# Altium schematic sheet 0244_GPU DECOUPLING_ VC.SchDoc
size 848 x 558 mm
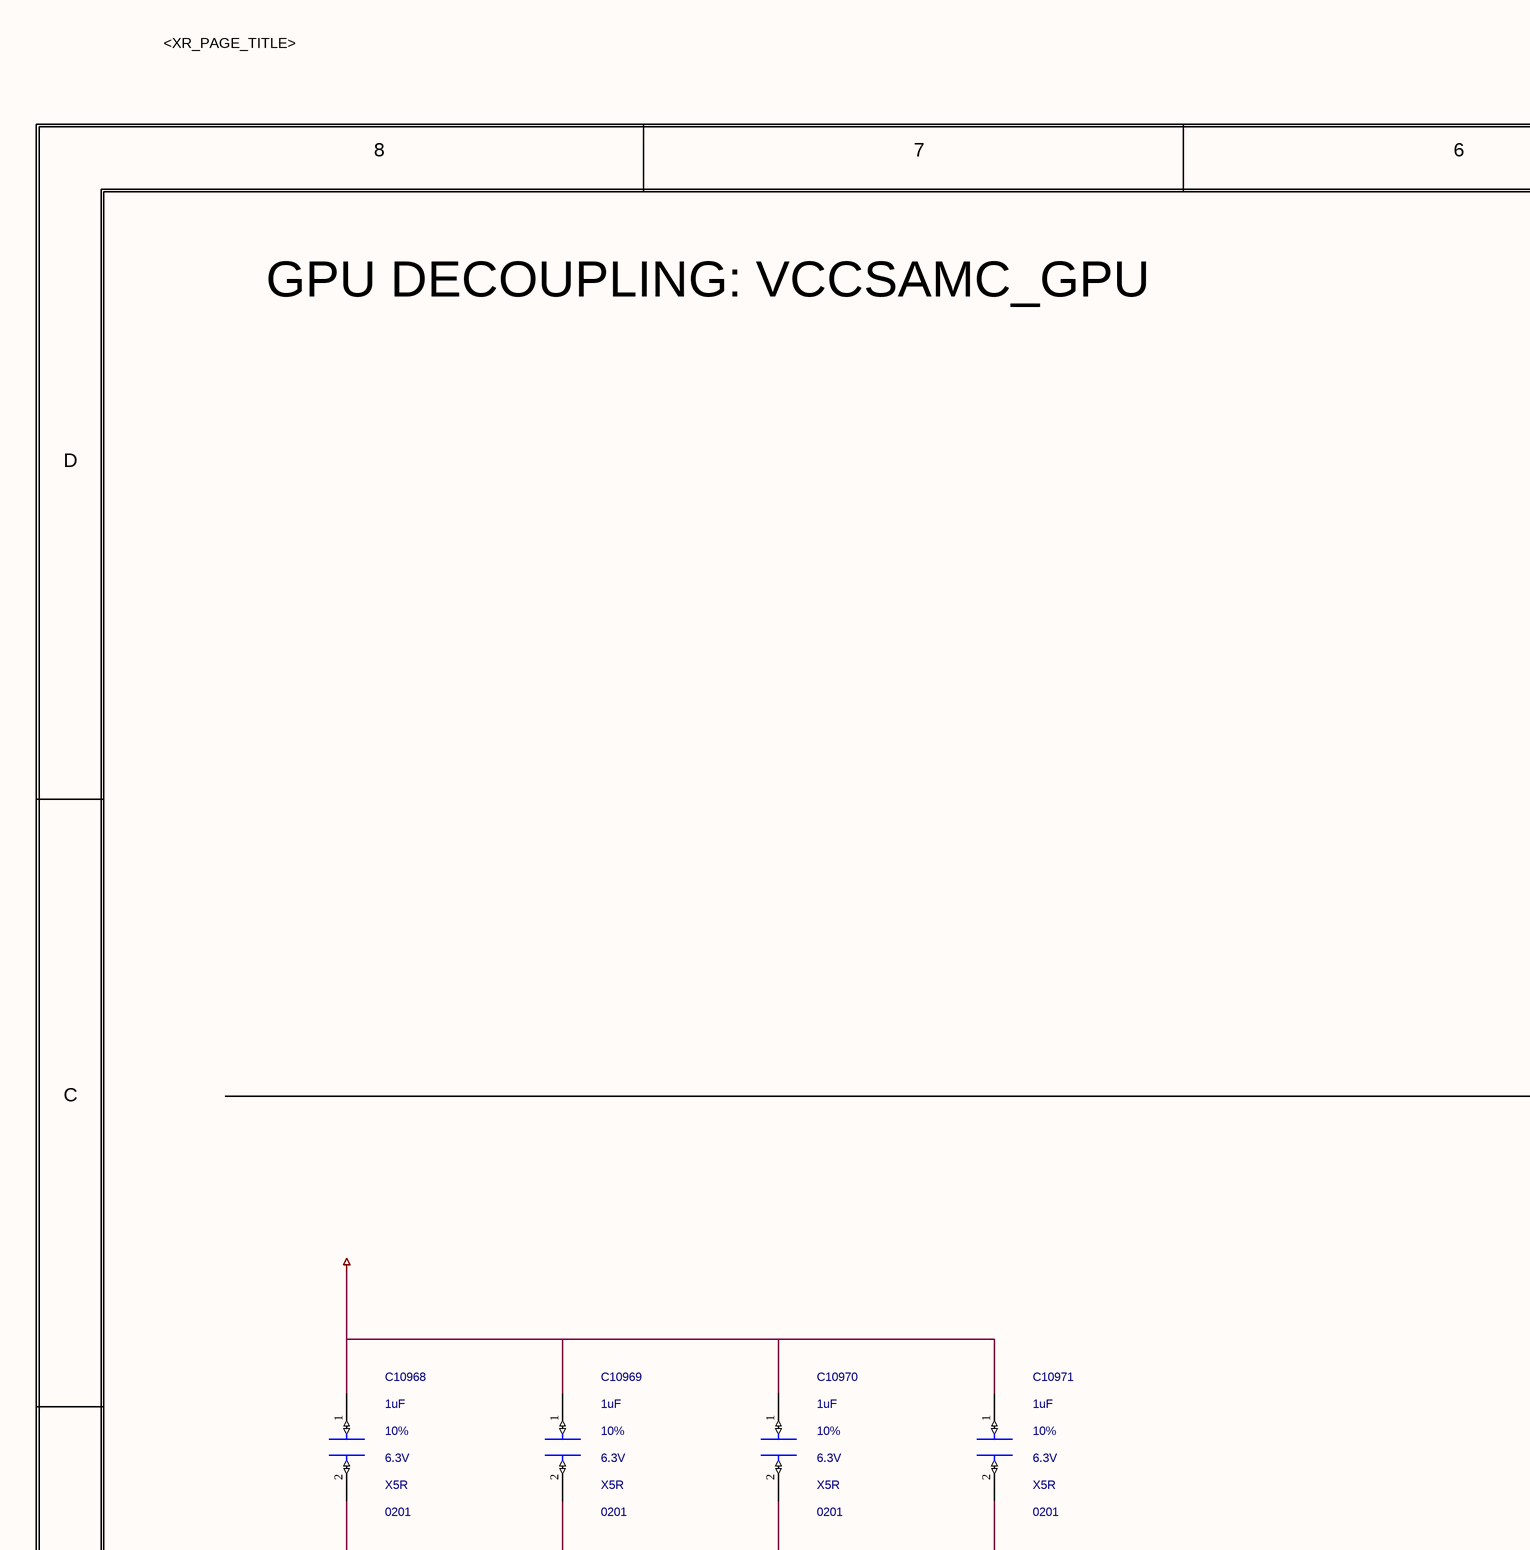
[diagram p0: 0244_GPU DECOUPLING_ VC.SchDoc, top left]
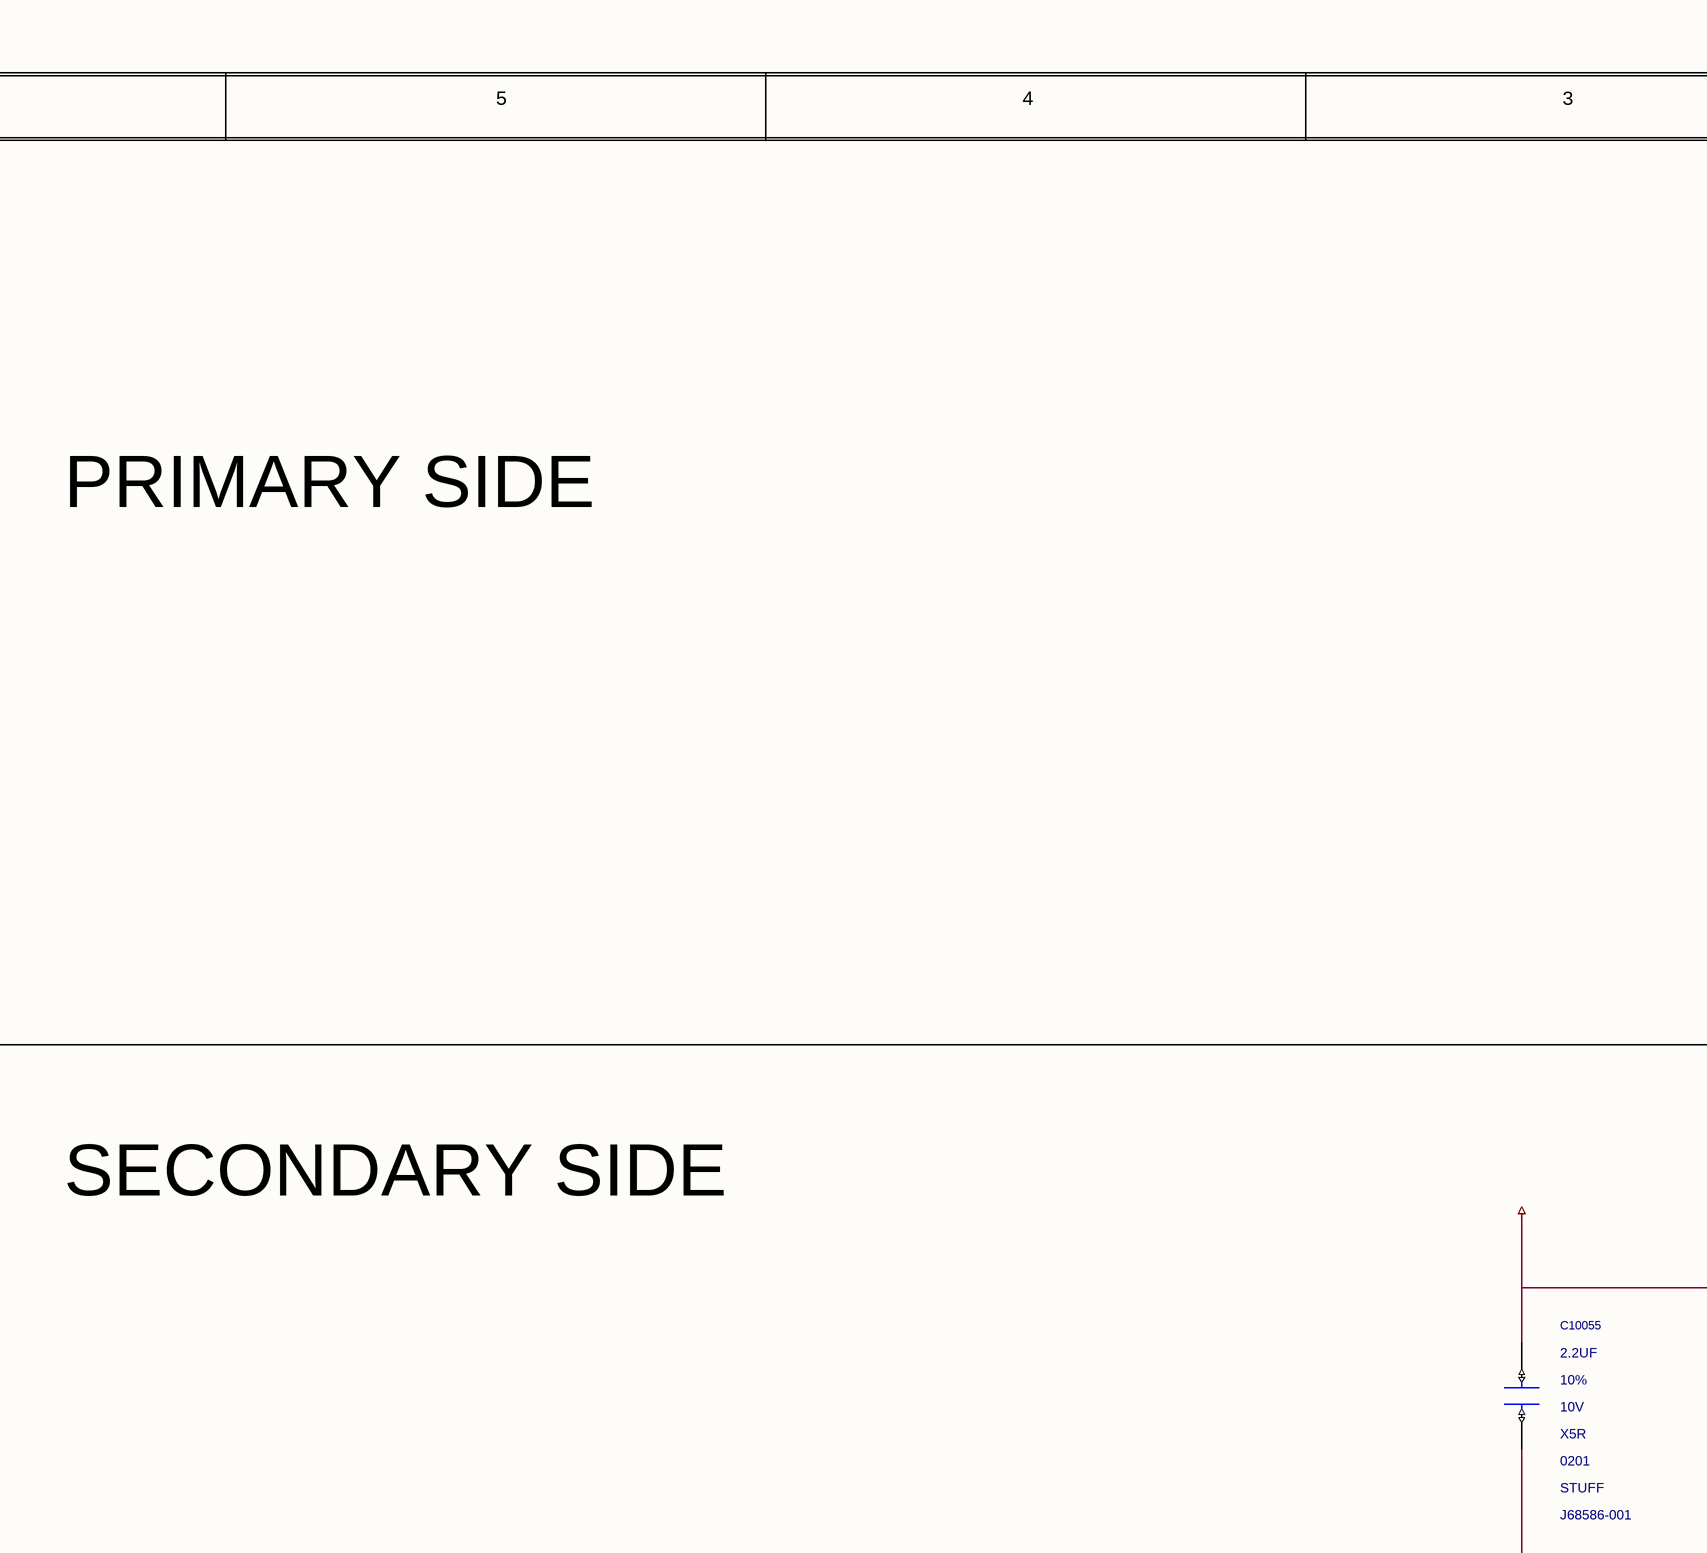
[diagram p1: 0244_GPU DECOUPLING_ VC.SchDoc, top middle]
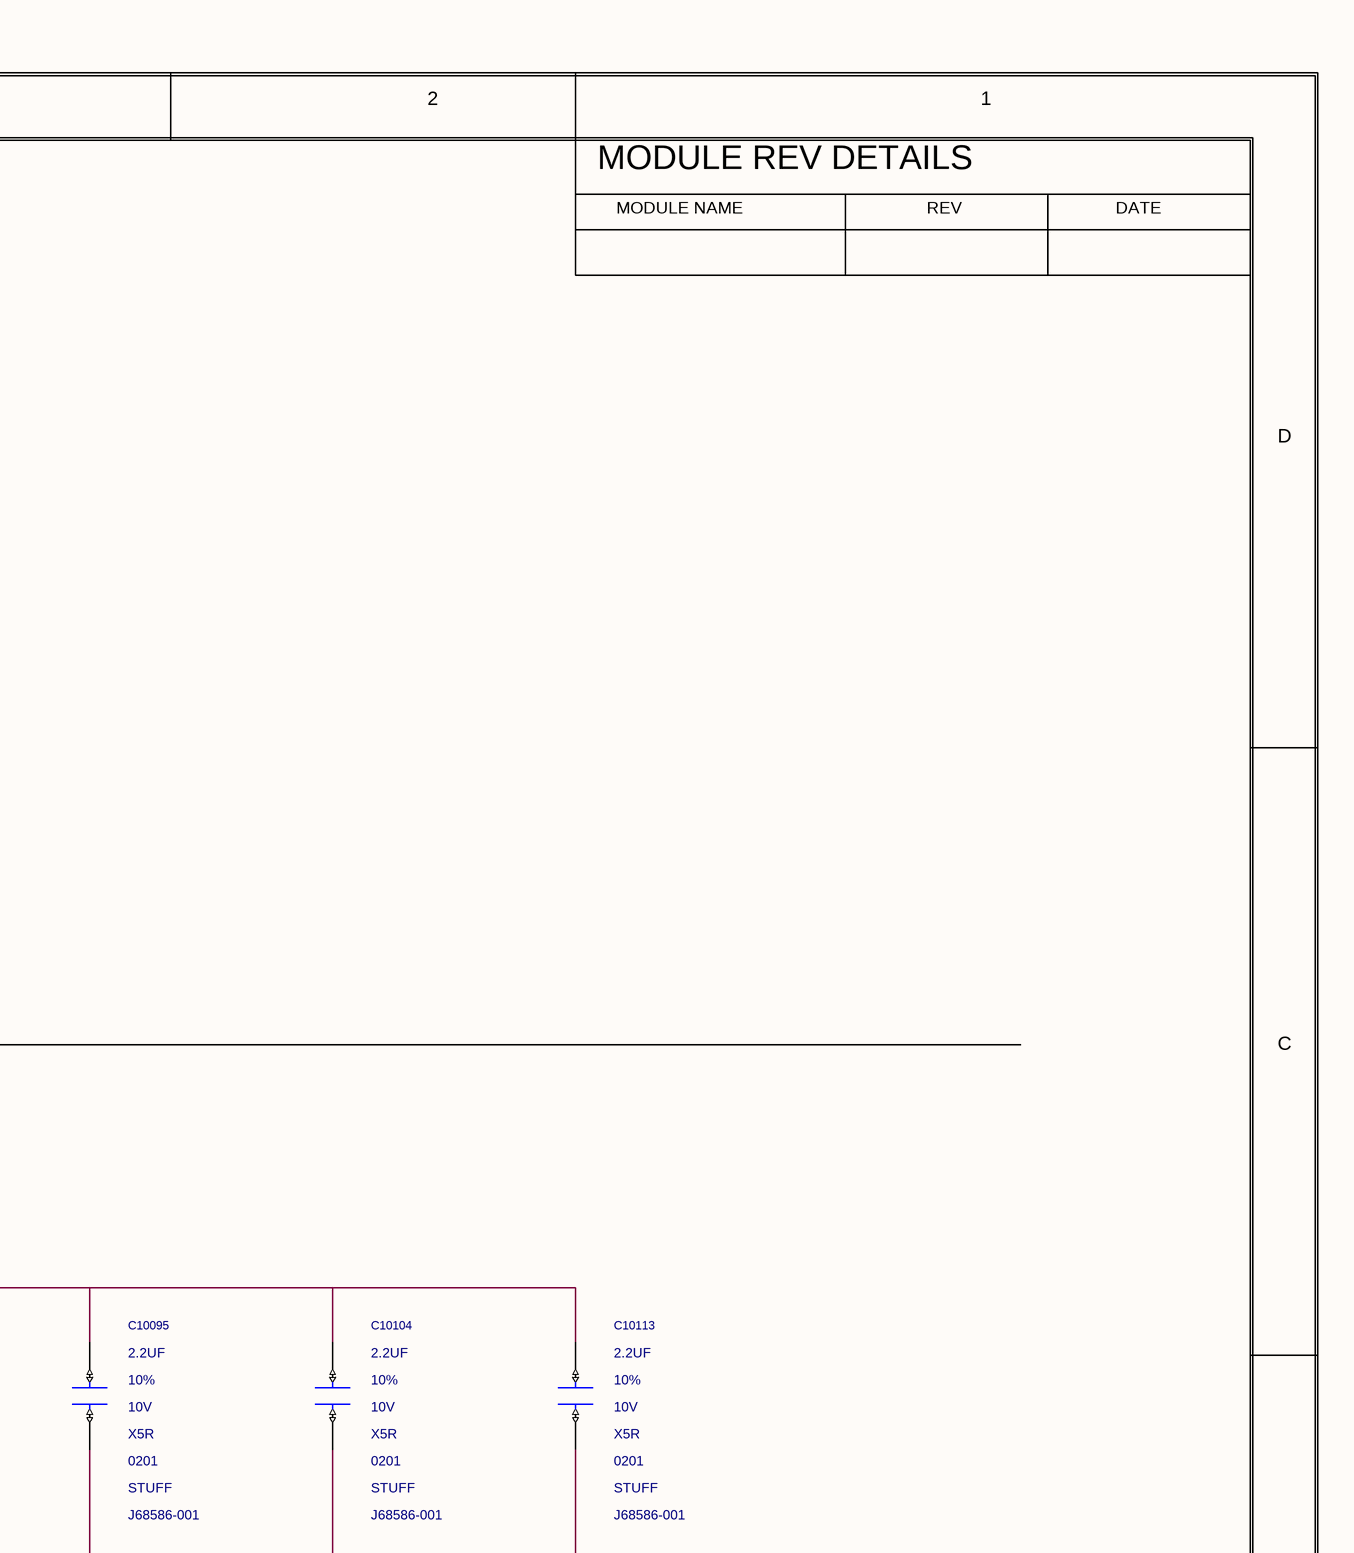
[diagram p2: 0244_GPU DECOUPLING_ VC.SchDoc, top right]
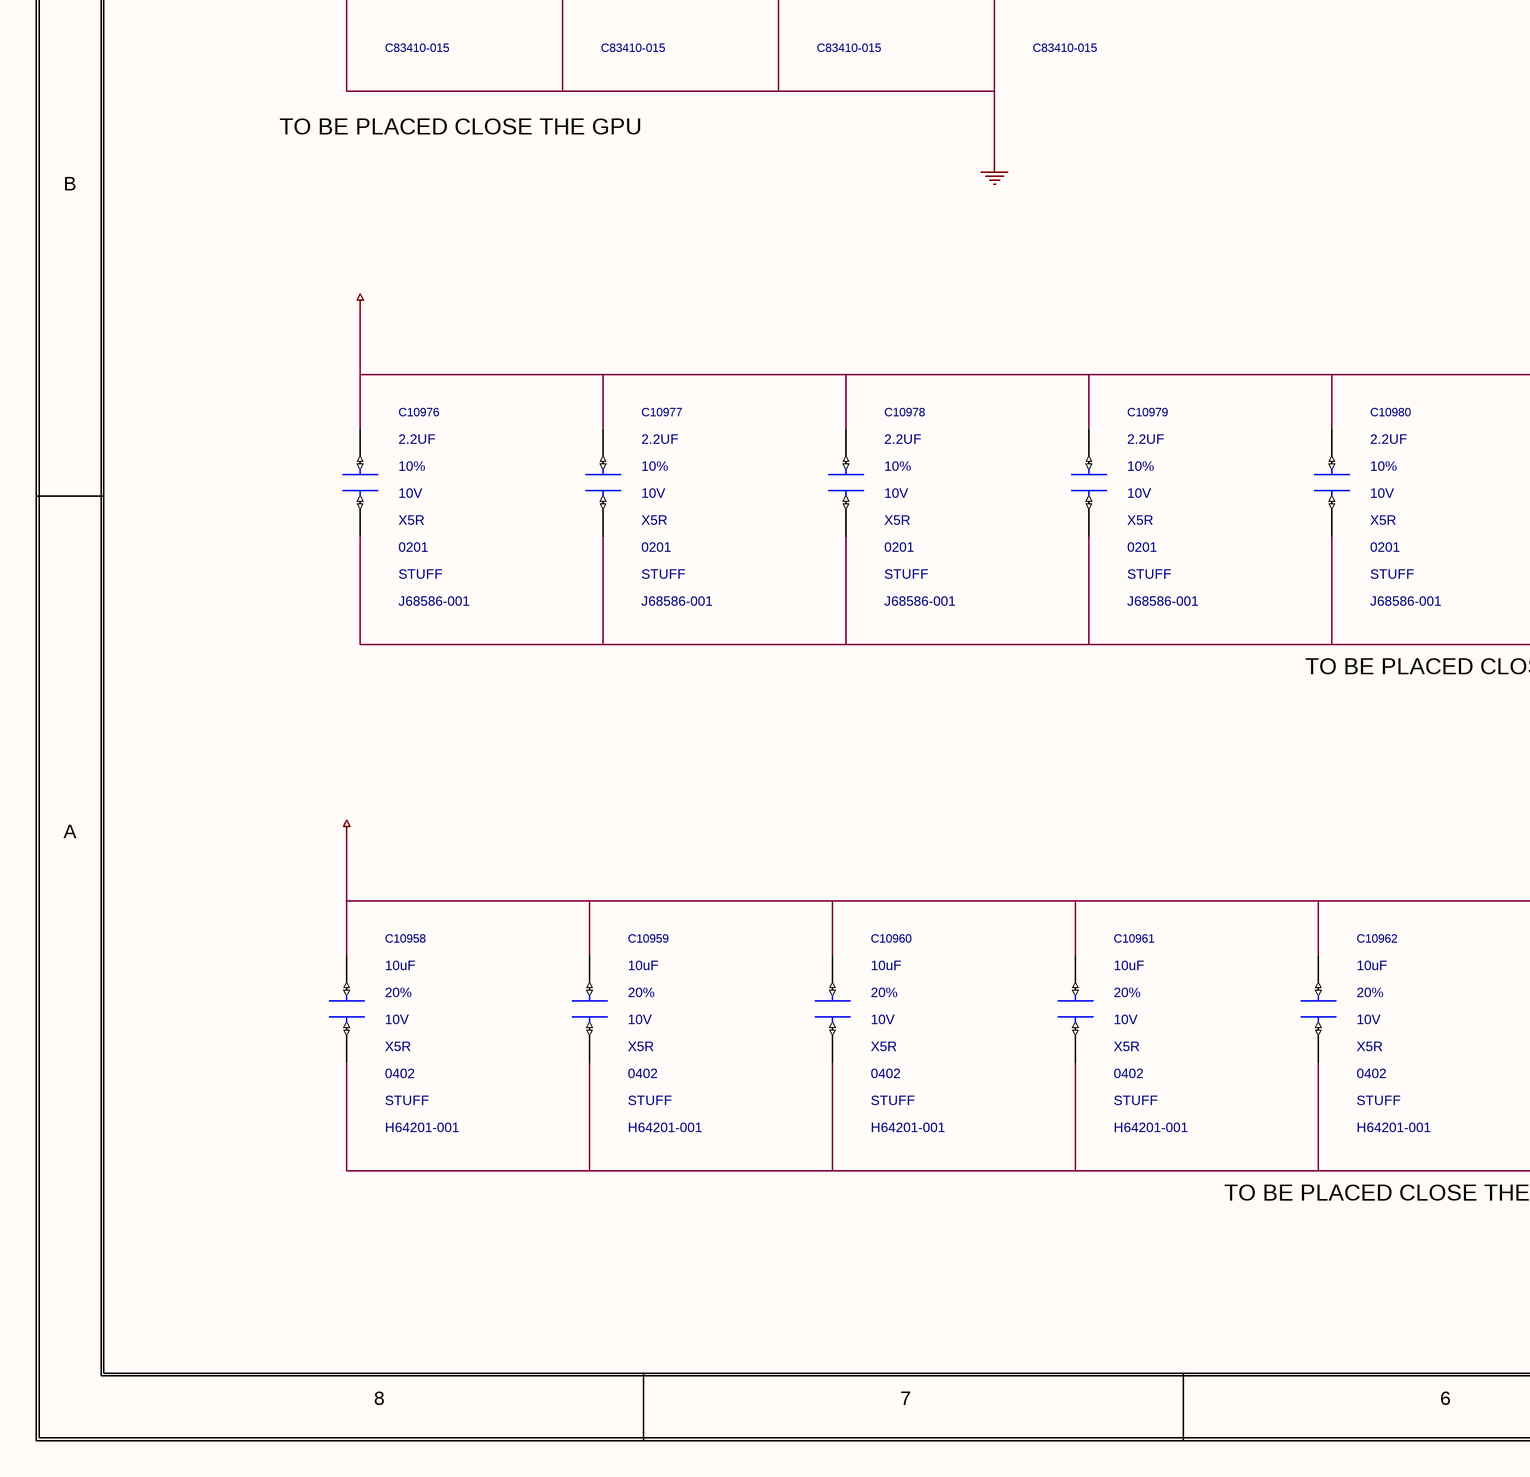
[diagram p3: 0244_GPU DECOUPLING_ VC.SchDoc, bottom left]
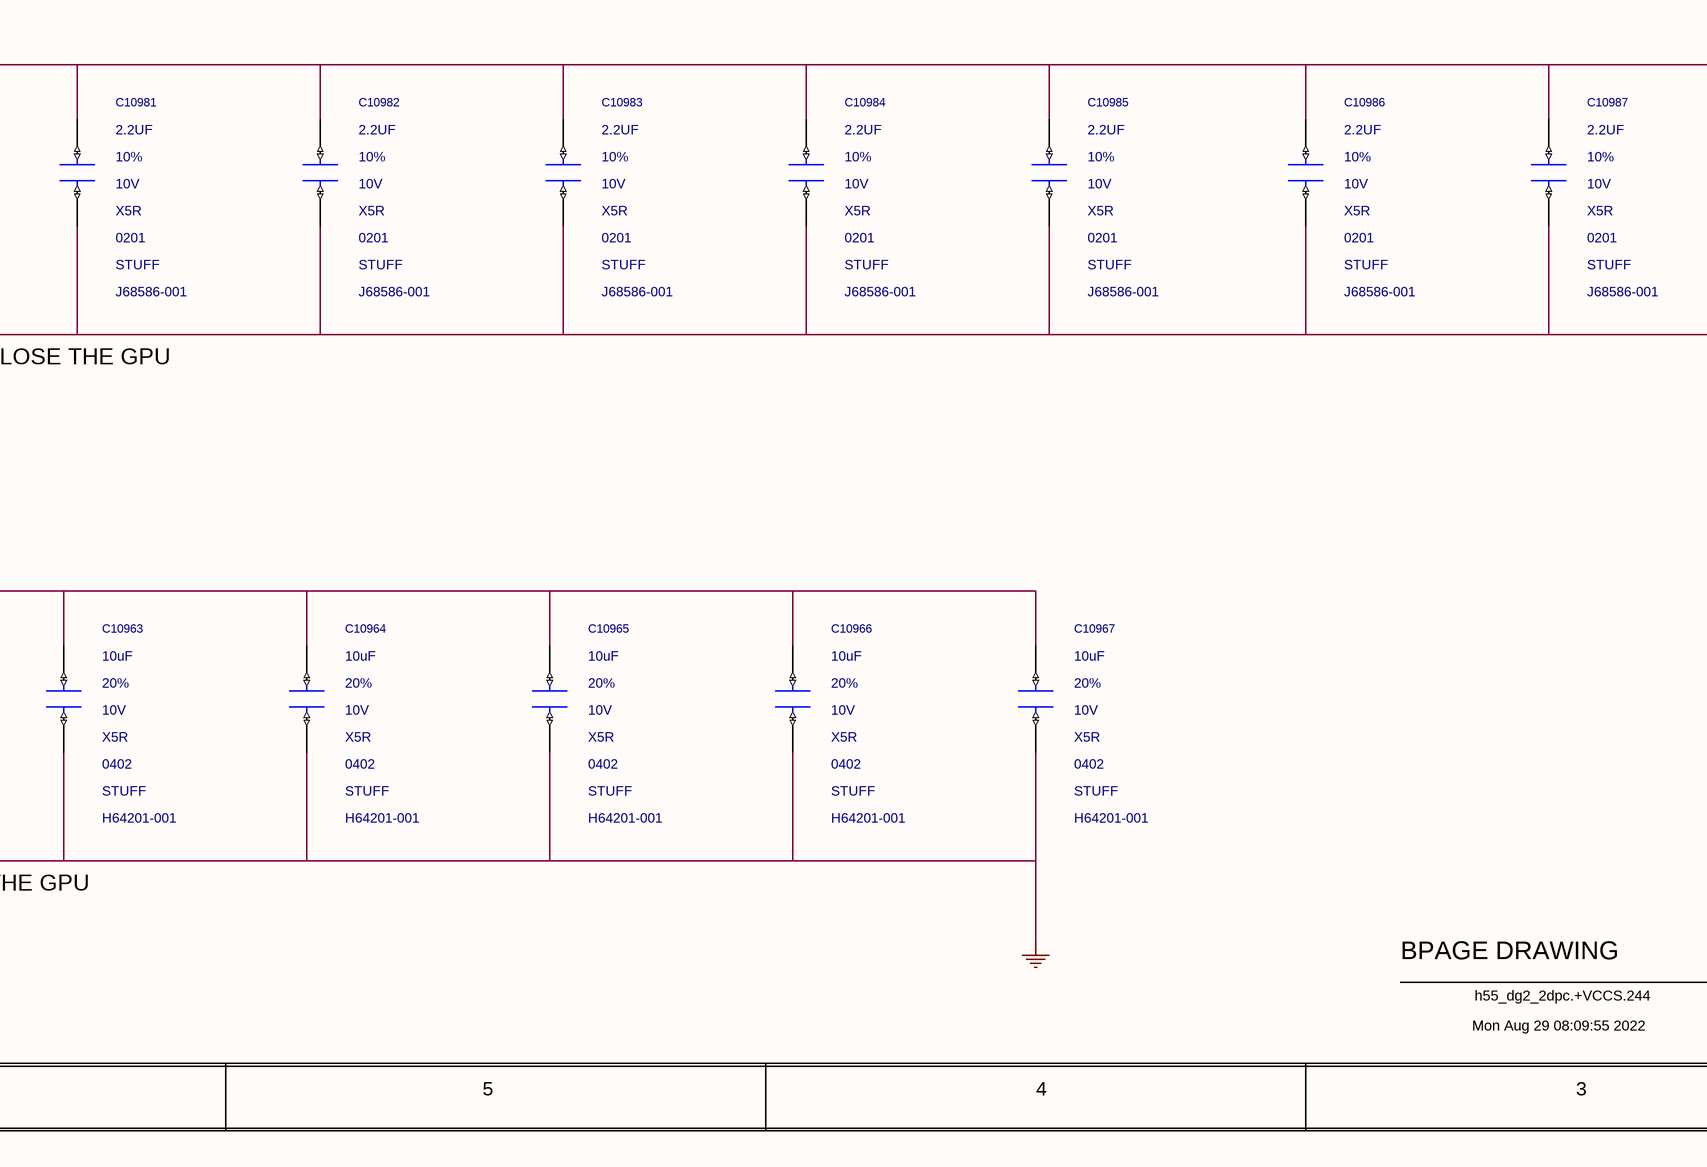
[diagram p4: 0244_GPU DECOUPLING_ VC.SchDoc, bottom middle]
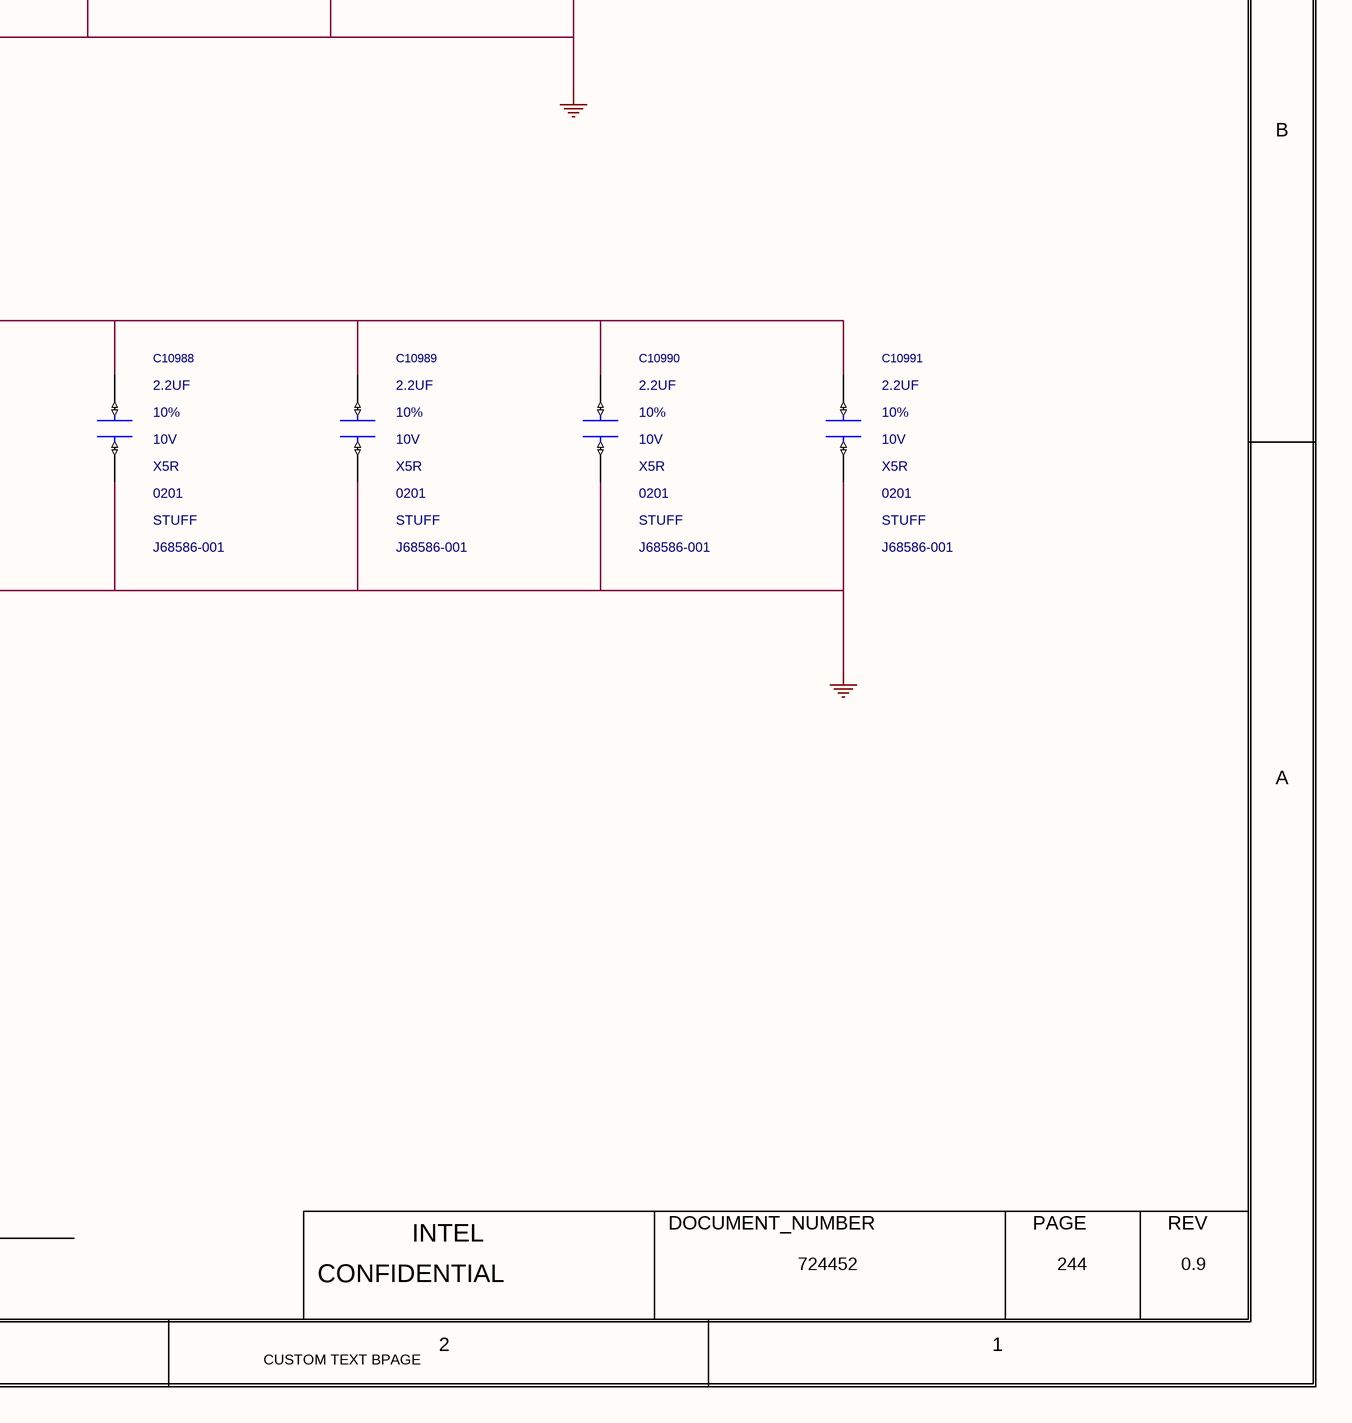
[diagram p5: 0244_GPU DECOUPLING_ VC.SchDoc, bottom right]

## Parts
C10055  2.2UF  BOM_USE: STUFF  MATERIAL: X5R  PACK_TYPE: 0201  PART_NUMBER: J68586-001  TOLERANCE: 10%  VOLTAGE: 10V  [TK0_SM0201_690X390_MC]
C10095  2.2UF  BOM_USE: STUFF  MATERIAL: X5R  PACK_TYPE: 0201  PART_NUMBER: J68586-001  TOLERANCE: 10%  VOLTAGE: 10V  [TK0_SM0201_690X390_MC]
C10104  2.2UF  BOM_USE: STUFF  MATERIAL: X5R  PACK_TYPE: 0201  PART_NUMBER: J68586-001  TOLERANCE: 10%  VOLTAGE: 10V  [TK0_SM0201_690X390_MC]
C10113  2.2UF  BOM_USE: STUFF  MATERIAL: X5R  PACK_TYPE: 0201  PART_NUMBER: J68586-001  TOLERANCE: 10%  VOLTAGE: 10V  [TK0_SM0201_690X390_MC]
C10958  10uF  BOM_USE: STUFF  MATERIAL: X5R  PACK_TYPE: 0402  PART_NUMBER: H64201-001  TOLERANCE: 20%  VOLTAGE: 10V  [TK0_SM0402_1200X700_MF]
C10959  10uF  BOM_USE: STUFF  MATERIAL: X5R  PACK_TYPE: 0402  PART_NUMBER: H64201-001  TOLERANCE: 20%  VOLTAGE: 10V  [TK0_SM0402_1200X700_MF]
C10960  10uF  BOM_USE: STUFF  MATERIAL: X5R  PACK_TYPE: 0402  PART_NUMBER: H64201-001  TOLERANCE: 20%  VOLTAGE: 10V  [TK0_SM0402_1200X700_MF]
C10961  10uF  BOM_USE: STUFF  MATERIAL: X5R  PACK_TYPE: 0402  PART_NUMBER: H64201-001  TOLERANCE: 20%  VOLTAGE: 10V  [TK0_SM0402_1200X700_MF]
C10962  10uF  BOM_USE: STUFF  MATERIAL: X5R  PACK_TYPE: 0402  PART_NUMBER: H64201-001  TOLERANCE: 20%  VOLTAGE: 10V  [TK0_SM0402_1200X700_MF]
C10963  10uF  BOM_USE: STUFF  MATERIAL: X5R  PACK_TYPE: 0402  PART_NUMBER: H64201-001  TOLERANCE: 20%  VOLTAGE: 10V  [TK0_SM0402_1200X700_MF]
C10964  10uF  BOM_USE: STUFF  MATERIAL: X5R  PACK_TYPE: 0402  PART_NUMBER: H64201-001  TOLERANCE: 20%  VOLTAGE: 10V  [TK0_SM0402_1200X700_MF]
C10965  10uF  BOM_USE: STUFF  MATERIAL: X5R  PACK_TYPE: 0402  PART_NUMBER: H64201-001  TOLERANCE: 20%  VOLTAGE: 10V  [TK0_SM0402_1200X700_MF]
C10966  10uF  BOM_USE: STUFF  MATERIAL: X5R  PACK_TYPE: 0402  PART_NUMBER: H64201-001  TOLERANCE: 20%  VOLTAGE: 10V  [TK0_SM0402_1200X700_MF]
C10967  10uF  BOM_USE: STUFF  MATERIAL: X5R  PACK_TYPE: 0402  PART_NUMBER: H64201-001  TOLERANCE: 20%  VOLTAGE: 10V  [TK0_SM0402_1200X700_MF]
C10968  1uF  MATERIAL: X5R  PACK_TYPE: 0201  PART_NUMBER: C83410-015  TOLERANCE: 10%  VOLTAGE: 6.3V  [SMC0201IA]
C10969  1uF  MATERIAL: X5R  PACK_TYPE: 0201  PART_NUMBER: C83410-015  TOLERANCE: 10%  VOLTAGE: 6.3V  [SMC0201IA]
C10970  1uF  MATERIAL: X5R  PACK_TYPE: 0201  PART_NUMBER: C83410-015  TOLERANCE: 10%  VOLTAGE: 6.3V  [SMC0201IA]
C10971  1uF  MATERIAL: X5R  PACK_TYPE: 0201  PART_NUMBER: C83410-015  TOLERANCE: 10%  VOLTAGE: 6.3V  [SMC0201IA]
C10976  2.2UF  BOM_USE: STUFF  MATERIAL: X5R  PACK_TYPE: 0201  PART_NUMBER: J68586-001  TOLERANCE: 10%  VOLTAGE: 10V  [TK0_SM0201_690X390_MC]
C10977  2.2UF  BOM_USE: STUFF  MATERIAL: X5R  PACK_TYPE: 0201  PART_NUMBER: J68586-001  TOLERANCE: 10%  VOLTAGE: 10V  [TK0_SM0201_690X390_MC]
C10978  2.2UF  BOM_USE: STUFF  MATERIAL: X5R  PACK_TYPE: 0201  PART_NUMBER: J68586-001  TOLERANCE: 10%  VOLTAGE: 10V  [TK0_SM0201_690X390_MC]
C10979  2.2UF  BOM_USE: STUFF  MATERIAL: X5R  PACK_TYPE: 0201  PART_NUMBER: J68586-001  TOLERANCE: 10%  VOLTAGE: 10V  [TK0_SM0201_690X390_MC]
C10980  2.2UF  BOM_USE: STUFF  MATERIAL: X5R  PACK_TYPE: 0201  PART_NUMBER: J68586-001  TOLERANCE: 10%  VOLTAGE: 10V  [TK0_SM0201_690X390_MC]
C10981  2.2UF  BOM_USE: STUFF  MATERIAL: X5R  PACK_TYPE: 0201  PART_NUMBER: J68586-001  TOLERANCE: 10%  VOLTAGE: 10V  [TK0_SM0201_690X390_MC]
C10982  2.2UF  BOM_USE: STUFF  MATERIAL: X5R  PACK_TYPE: 0201  PART_NUMBER: J68586-001  TOLERANCE: 10%  VOLTAGE: 10V  [TK0_SM0201_690X390_MC]
C10983  2.2UF  BOM_USE: STUFF  MATERIAL: X5R  PACK_TYPE: 0201  PART_NUMBER: J68586-001  TOLERANCE: 10%  VOLTAGE: 10V  [TK0_SM0201_690X390_MC]
C10984  2.2UF  BOM_USE: STUFF  MATERIAL: X5R  PACK_TYPE: 0201  PART_NUMBER: J68586-001  TOLERANCE: 10%  VOLTAGE: 10V  [TK0_SM0201_690X390_MC]
C10985  2.2UF  BOM_USE: STUFF  MATERIAL: X5R  PACK_TYPE: 0201  PART_NUMBER: J68586-001  TOLERANCE: 10%  VOLTAGE: 10V  [TK0_SM0201_690X390_MC]
C10986  2.2UF  BOM_USE: STUFF  MATERIAL: X5R  PACK_TYPE: 0201  PART_NUMBER: J68586-001  TOLERANCE: 10%  VOLTAGE: 10V  [TK0_SM0201_690X390_MC]
C10987  2.2UF  BOM_USE: STUFF  MATERIAL: X5R  PACK_TYPE: 0201  PART_NUMBER: J68586-001  TOLERANCE: 10%  VOLTAGE: 10V  [TK0_SM0201_690X390_MC]
C10988  2.2UF  BOM_USE: STUFF  MATERIAL: X5R  PACK_TYPE: 0201  PART_NUMBER: J68586-001  TOLERANCE: 10%  VOLTAGE: 10V  [TK0_SM0201_690X390_MC]
C10989  2.2UF  BOM_USE: STUFF  MATERIAL: X5R  PACK_TYPE: 0201  PART_NUMBER: J68586-001  TOLERANCE: 10%  VOLTAGE: 10V  [TK0_SM0201_690X390_MC]
C10990  2.2UF  BOM_USE: STUFF  MATERIAL: X5R  PACK_TYPE: 0201  PART_NUMBER: J68586-001  TOLERANCE: 10%  VOLTAGE: 10V  [TK0_SM0201_690X390_MC]
C10991  2.2UF  BOM_USE: STUFF  MATERIAL: X5R  PACK_TYPE: 0201  PART_NUMBER: J68586-001  TOLERANCE: 10%  VOLTAGE: 10V  [TK0_SM0201_690X390_MC]

## Nets
+VCCSAMC_GPU: C10055.1(A) C10095.1(A) C10104.1(A) C10113.1(A) C10958.1(A) C10959.1(A) C10960.1(A) C10961.1(A) C10962.1(A) C10963.1(A) C10964.1(A) C10965.1(A) C10966.1(A) C10967.1(A) C10968.1(A) C10969.1(A) C10970.1(A) C10971.1(A) C10976.1(A) C10977.1(A) C10978.1(A) C10979.1(A) C10980.1(A) C10981.1(A) C10982.1(A) C10983.1(A) C10984.1(A) C10985.1(A) C10986.1(A) C10987.1(A) C10988.1(A) C10989.1(A) C10990.1(A) C10991.1(A)
GND: C10055.2(B) C10095.2(B) C10104.2(B) C10113.2(B) C10958.2(B) C10959.2(B) C10960.2(B) C10961.2(B) C10962.2(B) C10963.2(B) C10964.2(B) C10965.2(B) C10966.2(B) C10967.2(B) C10968.2(B) C10969.2(B) C10970.2(B) C10971.2(B) C10976.2(B) C10977.2(B) C10978.2(B) C10979.2(B) C10980.2(B) C10981.2(B) C10982.2(B) C10983.2(B) C10984.2(B) C10985.2(B) C10986.2(B) C10987.2(B) C10988.2(B) C10989.2(B) C10990.2(B) C10991.2(B)

## Notes on the sheet
- <XR_PAGE_TITLE>
- 8
- 7
- 6
- 5
- 4
- 3
- 2
- 1
- MODULE REV DETAILS
- GPU DECOUPLING: VCCSAMC_GPU
- MODULE NAME
- REV
- DATE
- D
- PRIMARY SIDE
- C
- SECONDARY SIDE
- TO BE PLACED CLOSE THE GPU
- B
- A
- BPAGE DRAWING
- INTEL
- DOCUMENT_NUMBER
- PAGE
- Mon Aug 29 08:09:55 2022
- h55_dg2_2dpc.+VCCS.244
- CONFIDENTIAL
- 724452
- 244
- 0.9
- CUSTOM TEXT BPAGE

## Library data of the parts
C10055 = CAP_2: CDS_PHYS_PART_NAME: CAP_2_0201-J68586-001,X5R,2.2UF,10V,10%,TK0,GENERIC; CDS_LMAN_SYM_OUTLINE: -50,50,50,-50; FP_TECH: TK0; IP: GENERIC; ROOM: NONE; OriginalSymbolOrigin: (-50,25); XY: (2625,1650); VER: 1; ROT: 0; PHYS_PAGE: 244; LOCATION: C10055; DRAWING: @RVP1_ADL_SB_ADP_S_DDR5_SODIMM_2DPC_LIB.H55_DG2_2DPC(SCH_1):PAGE415; CDS_LIB: discrete_2; VARIANT: ?; PCB Footprint: TK0_SM0201_690X390_MC; CHIPS_PART_NAME: CAP_2; CDS_PART_NAME: CAP_2_0201-J68586-001,X5R,2.2UF,10V,10%,TK0,GENERIC; CDS_LOCATION: C10055
C10095 = CAP_2: CDS_PHYS_PART_NAME: CAP_2_0201-J68586-001,X5R,2.2UF,10V,10%,TK0,GENERIC; CDS_LMAN_SYM_OUTLINE: -50,50,50,-50; FP_TECH: TK0; IP: GENERIC; ROOM: NONE; OriginalSymbolOrigin: (-50,25); XY: (3075,1650); VER: 1; ROT: 0; PHYS_PAGE: 244; LOCATION: C10095; DRAWING: @RVP1_ADL_SB_ADP_S_DDR5_SODIMM_2DPC_LIB.H55_DG2_2DPC(SCH_1):PAGE415; CDS_LIB: discrete_2; VARIANT: ?; PCB Footprint: TK0_SM0201_690X390_MC; CHIPS_PART_NAME: CAP_2; CDS_PART_NAME: CAP_2_0201-J68586-001,X5R,2.2UF,10V,10%,TK0,GENERIC; CDS_LOCATION: C10095
C10104 = CAP_2: CDS_PHYS_PART_NAME: CAP_2_0201-J68586-001,X5R,2.2UF,10V,10%,TK0,GENERIC; CDS_LMAN_SYM_OUTLINE: -50,50,50,-50; FP_TECH: TK0; IP: GENERIC; ROOM: NONE; OriginalSymbolOrigin: (-50,25); XY: (3525,1650); VER: 1; ROT: 0; PHYS_PAGE: 244; LOCATION: C10104; DRAWING: @RVP1_ADL_SB_ADP_S_DDR5_SODIMM_2DPC_LIB.H55_DG2_2DPC(SCH_1):PAGE415; CDS_LIB: discrete_2; VARIANT: ?; PCB Footprint: TK0_SM0201_690X390_MC; CHIPS_PART_NAME: CAP_2; CDS_PART_NAME: CAP_2_0201-J68586-001,X5R,2.2UF,10V,10%,TK0,GENERIC; CDS_LOCATION: C10104
C10113 = CAP_2: CDS_PHYS_PART_NAME: CAP_2_0201-J68586-001,X5R,2.2UF,10V,10%,TK0,GENERIC; CDS_LMAN_SYM_OUTLINE: -50,50,50,-50; FP_TECH: TK0; IP: GENERIC; ROOM: NONE; OriginalSymbolOrigin: (-50,25); XY: (3975,1650); VER: 1; ROT: 0; PHYS_PAGE: 244; LOCATION: C10113; DRAWING: @RVP1_ADL_SB_ADP_S_DDR5_SODIMM_2DPC_LIB.H55_DG2_2DPC(SCH_1):PAGE415; CDS_LIB: discrete_2; VARIANT: ?; PCB Footprint: TK0_SM0201_690X390_MC; CHIPS_PART_NAME: CAP_2; CDS_PART_NAME: CAP_2_0201-J68586-001,X5R,2.2UF,10V,10%,TK0,GENERIC; CDS_LOCATION: C10113
C10958 = CAP_2: CDS_PHYS_PART_NAME: CAP_2_0402-H64201-001,X5R,10UF,10V,20%,TK0,GENERIC; CDS_LMAN_SYM_OUTLINE: -50,50,50,-50; FP_TECH: TK0; IP: GENERIC; ROOM: NONE; OriginalSymbolOrigin: (-50,25); XY: (-2325,-350); VER: 1; ROT: 0; PHYS_PAGE: 244; LOCATION: C10958; DRAWING: @RVP1_ADL_SB_ADP_S_DDR5_SODIMM_2DPC_LIB.H55_DG2_2DPC(SCH_1):PAGE415; CDS_LIB: discrete_2; VARIANT: ?; PCB Footprint: TK0_SM0402_1200X700_MF; CHIPS_PART_NAME: CAP_2; CDS_PART_NAME: CAP_2_0402-H64201-001,X5R,10UF,10V,20%,TK0,GENERIC; CDS_LOCATION: C10958
C10959 = CAP_2: CDS_PHYS_PART_NAME: CAP_2_0402-H64201-001,X5R,10UF,10V,20%,TK0,GENERIC; CDS_LMAN_SYM_OUTLINE: -50,50,50,-50; FP_TECH: TK0; IP: GENERIC; ROOM: NONE; OriginalSymbolOrigin: (-50,25); XY: (-1875,-350); VER: 1; ROT: 0; PHYS_PAGE: 244; LOCATION: C10959; DRAWING: @RVP1_ADL_SB_ADP_S_DDR5_SODIMM_2DPC_LIB.H55_DG2_2DPC(SCH_1):PAGE415; CDS_LIB: discrete_2; VARIANT: ?; PCB Footprint: TK0_SM0402_1200X700_MF; CHIPS_PART_NAME: CAP_2; CDS_PART_NAME: CAP_2_0402-H64201-001,X5R,10UF,10V,20%,TK0,GENERIC; CDS_LOCATION: C10959
C10960 = CAP_2: CDS_PHYS_PART_NAME: CAP_2_0402-H64201-001,X5R,10UF,10V,20%,TK0,GENERIC; CDS_LMAN_SYM_OUTLINE: -50,50,50,-50; FP_TECH: TK0; IP: GENERIC; ROOM: NONE; OriginalSymbolOrigin: (-50,25); XY: (-1425,-350); VER: 1; ROT: 0; PHYS_PAGE: 244; LOCATION: C10960; DRAWING: @RVP1_ADL_SB_ADP_S_DDR5_SODIMM_2DPC_LIB.H55_DG2_2DPC(SCH_1):PAGE415; CDS_LIB: discrete_2; VARIANT: ?; PCB Footprint: TK0_SM0402_1200X700_MF; CHIPS_PART_NAME: CAP_2; CDS_PART_NAME: CAP_2_0402-H64201-001,X5R,10UF,10V,20%,TK0,GENERIC; CDS_LOCATION: C10960
C10961 = CAP_2: CDS_PHYS_PART_NAME: CAP_2_0402-H64201-001,X5R,10UF,10V,20%,TK0,GENERIC; CDS_LMAN_SYM_OUTLINE: -50,50,50,-50; FP_TECH: TK0; IP: GENERIC; ROOM: NONE; OriginalSymbolOrigin: (-50,25); XY: (-975,-350); VER: 1; ROT: 0; PHYS_PAGE: 244; LOCATION: C10961; DRAWING: @RVP1_ADL_SB_ADP_S_DDR5_SODIMM_2DPC_LIB.H55_DG2_2DPC(SCH_1):PAGE415; CDS_LIB: discrete_2; VARIANT: ?; PCB Footprint: TK0_SM0402_1200X700_MF; CHIPS_PART_NAME: CAP_2; CDS_PART_NAME: CAP_2_0402-H64201-001,X5R,10UF,10V,20%,TK0,GENERIC; CDS_LOCATION: C10961
C10962 = CAP_2: CDS_PHYS_PART_NAME: CAP_2_0402-H64201-001,X5R,10UF,10V,20%,TK0,GENERIC; CDS_LMAN_SYM_OUTLINE: -50,50,50,-50; FP_TECH: TK0; IP: GENERIC; ROOM: NONE; OriginalSymbolOrigin: (-50,25); XY: (-525,-350); VER: 1; ROT: 0; PHYS_PAGE: 244; LOCATION: C10962; DRAWING: @RVP1_ADL_SB_ADP_S_DDR5_SODIMM_2DPC_LIB.H55_DG2_2DPC(SCH_1):PAGE415; CDS_LIB: discrete_2; VARIANT: ?; PCB Footprint: TK0_SM0402_1200X700_MF; CHIPS_PART_NAME: CAP_2; CDS_PART_NAME: CAP_2_0402-H64201-001,X5R,10UF,10V,20%,TK0,GENERIC; CDS_LOCATION: C10962
C10963 = CAP_2: CDS_PHYS_PART_NAME: CAP_2_0402-H64201-001,X5R,10UF,10V,20%,TK0,GENERIC; CDS_LMAN_SYM_OUTLINE: -50,50,50,-50; FP_TECH: TK0; IP: GENERIC; ROOM: NONE; OriginalSymbolOrigin: (-50,25); XY: (-75,-350); VER: 1; ROT: 0; PHYS_PAGE: 244; LOCATION: C10963; DRAWING: @RVP1_ADL_SB_ADP_S_DDR5_SODIMM_2DPC_LIB.H55_DG2_2DPC(SCH_1):PAGE415; CDS_LIB: discrete_2; VARIANT: ?; PCB Footprint: TK0_SM0402_1200X700_MF; CHIPS_PART_NAME: CAP_2; CDS_PART_NAME: CAP_2_0402-H64201-001,X5R,10UF,10V,20%,TK0,GENERIC; CDS_LOCATION: C10963
C10964 = CAP_2: CDS_PHYS_PART_NAME: CAP_2_0402-H64201-001,X5R,10UF,10V,20%,TK0,GENERIC; CDS_LMAN_SYM_OUTLINE: -50,50,50,-50; FP_TECH: TK0; IP: GENERIC; ROOM: NONE; OriginalSymbolOrigin: (-50,25); XY: (375,-350); VER: 1; ROT: 0; PHYS_PAGE: 244; LOCATION: C10964; DRAWING: @RVP1_ADL_SB_ADP_S_DDR5_SODIMM_2DPC_LIB.H55_DG2_2DPC(SCH_1):PAGE415; CDS_LIB: discrete_2; VARIANT: ?; PCB Footprint: TK0_SM0402_1200X700_MF; CHIPS_PART_NAME: CAP_2; CDS_PART_NAME: CAP_2_0402-H64201-001,X5R,10UF,10V,20%,TK0,GENERIC; CDS_LOCATION: C10964
C10965 = CAP_2: CDS_PHYS_PART_NAME: CAP_2_0402-H64201-001,X5R,10UF,10V,20%,TK0,GENERIC; CDS_LMAN_SYM_OUTLINE: -50,50,50,-50; FP_TECH: TK0; IP: GENERIC; ROOM: NONE; OriginalSymbolOrigin: (-50,25); XY: (825,-350); VER: 1; ROT: 0; PHYS_PAGE: 244; LOCATION: C10965; DRAWING: @RVP1_ADL_SB_ADP_S_DDR5_SODIMM_2DPC_LIB.H55_DG2_2DPC(SCH_1):PAGE415; CDS_LIB: discrete_2; VARIANT: ?; PCB Footprint: TK0_SM0402_1200X700_MF; CHIPS_PART_NAME: CAP_2; CDS_PART_NAME: CAP_2_0402-H64201-001,X5R,10UF,10V,20%,TK0,GENERIC; CDS_LOCATION: C10965
C10966 = CAP_2: CDS_PHYS_PART_NAME: CAP_2_0402-H64201-001,X5R,10UF,10V,20%,TK0,GENERIC; CDS_LMAN_SYM_OUTLINE: -50,50,50,-50; FP_TECH: TK0; IP: GENERIC; ROOM: NONE; OriginalSymbolOrigin: (-50,25); XY: (1275,-350); VER: 1; ROT: 0; PHYS_PAGE: 244; LOCATION: C10966; DRAWING: @RVP1_ADL_SB_ADP_S_DDR5_SODIMM_2DPC_LIB.H55_DG2_2DPC(SCH_1):PAGE415; CDS_LIB: discrete_2; VARIANT: ?; PCB Footprint: TK0_SM0402_1200X700_MF; CHIPS_PART_NAME: CAP_2; CDS_PART_NAME: CAP_2_0402-H64201-001,X5R,10UF,10V,20%,TK0,GENERIC; CDS_LOCATION: C10966
C10967 = CAP_2: CDS_PHYS_PART_NAME: CAP_2_0402-H64201-001,X5R,10UF,10V,20%,TK0,GENERIC; CDS_LMAN_SYM_OUTLINE: -50,50,50,-50; FP_TECH: TK0; IP: GENERIC; ROOM: NONE; OriginalSymbolOrigin: (-50,25); XY: (1725,-350); VER: 1; ROT: 0; PHYS_PAGE: 244; LOCATION: C10967; DRAWING: @RVP1_ADL_SB_ADP_S_DDR5_SODIMM_2DPC_LIB.H55_DG2_2DPC(SCH_1):PAGE415; CDS_LIB: discrete_2; VARIANT: ?; PCB Footprint: TK0_SM0402_1200X700_MF; CHIPS_PART_NAME: CAP_2; CDS_PART_NAME: CAP_2_0402-H64201-001,X5R,10UF,10V,20%,TK0,GENERIC; CDS_LOCATION: C10967
C10968 = CAP: CDS_PHYS_PART_NAME: CAP_0201-C83410-015,X5R,1UF,6.3V,10%,LPDB,GENERIC; OriginalSymbolOrigin: (-50,25); XY: (-2325,1650); VER: 1; ROT: 0; PHYS_PAGE: 244; LOCATION: C10968; DRAWING: @RVP1_ADL_SB_ADP_S_DDR5_SODIMM_2DPC_LIB.H55_DG2_2DPC(SCH_1):PAGE415; CDS_LIB: discrete; PCB Footprint: SMC0201IA; CHIPS_PART_NAME: CAP; CDS_PART_NAME: CAP_0201-C83410-015,X5R,1UF,6.3V,10%,LPDB,GENERIC; CDS_LOCATION: C10968
C10969 = CAP: CDS_PHYS_PART_NAME: CAP_0201-C83410-015,X5R,1UF,6.3V,10%,LPDB,GENERIC; OriginalSymbolOrigin: (-50,25); XY: (-1925,1650); VER: 1; ROT: 0; PHYS_PAGE: 244; LOCATION: C10969; DRAWING: @RVP1_ADL_SB_ADP_S_DDR5_SODIMM_2DPC_LIB.H55_DG2_2DPC(SCH_1):PAGE415; CDS_LIB: discrete; PCB Footprint: SMC0201IA; CHIPS_PART_NAME: CAP; CDS_PART_NAME: CAP_0201-C83410-015,X5R,1UF,6.3V,10%,LPDB,GENERIC; CDS_LOCATION: C10969
C10970 = CAP: CDS_PHYS_PART_NAME: CAP_0201-C83410-015,X5R,1UF,6.3V,10%,LPDB,GENERIC; OriginalSymbolOrigin: (-50,25); XY: (-1525,1650); VER: 1; ROT: 0; PHYS_PAGE: 244; LOCATION: C10970; DRAWING: @RVP1_ADL_SB_ADP_S_DDR5_SODIMM_2DPC_LIB.H55_DG2_2DPC(SCH_1):PAGE415; CDS_LIB: discrete; PCB Footprint: SMC0201IA; CHIPS_PART_NAME: CAP; CDS_PART_NAME: CAP_0201-C83410-015,X5R,1UF,6.3V,10%,LPDB,GENERIC; CDS_LOCATION: C10970
C10971 = CAP: CDS_PHYS_PART_NAME: CAP_0201-C83410-015,X5R,1UF,6.3V,10%,LPDB,GENERIC; OriginalSymbolOrigin: (-50,25); XY: (-1125,1650); VER: 1; ROT: 0; PHYS_PAGE: 244; LOCATION: C10971; DRAWING: @RVP1_ADL_SB_ADP_S_DDR5_SODIMM_2DPC_LIB.H55_DG2_2DPC(SCH_1):PAGE415; CDS_LIB: discrete; PCB Footprint: SMC0201IA; CHIPS_PART_NAME: CAP; CDS_PART_NAME: CAP_0201-C83410-015,X5R,1UF,6.3V,10%,LPDB,GENERIC; CDS_LOCATION: C10971
C10976 = CAP_2: CDS_PHYS_PART_NAME: CAP_2_0201-J68586-001,X5R,2.2UF,10V,10%,TK0,GENERIC; CDS_LMAN_SYM_OUTLINE: -50,50,50,-50; FP_TECH: TK0; IP: GENERIC; ROOM: NONE; OriginalSymbolOrigin: (-50,25); XY: (-2300,625); VER: 1; ROT: 0; PHYS_PAGE: 244; LOCATION: C10976; DRAWING: @RVP1_ADL_SB_ADP_S_DDR5_SODIMM_2DPC_LIB.H55_DG2_2DPC(SCH_1):PAGE415; CDS_LIB: discrete_2; VARIANT: ?; PCB Footprint: TK0_SM0201_690X390_MC; CHIPS_PART_NAME: CAP_2; CDS_PART_NAME: CAP_2_0201-J68586-001,X5R,2.2UF,10V,10%,TK0,GENERIC; CDS_LOCATION: C10976
C10977 = CAP_2: CDS_PHYS_PART_NAME: CAP_2_0201-J68586-001,X5R,2.2UF,10V,10%,TK0,GENERIC; CDS_LMAN_SYM_OUTLINE: -50,50,50,-50; FP_TECH: TK0; IP: GENERIC; ROOM: NONE; OriginalSymbolOrigin: (-50,25); XY: (-1850,625); VER: 1; ROT: 0; PHYS_PAGE: 244; LOCATION: C10977; DRAWING: @RVP1_ADL_SB_ADP_S_DDR5_SODIMM_2DPC_LIB.H55_DG2_2DPC(SCH_1):PAGE415; CDS_LIB: discrete_2; VARIANT: ?; PCB Footprint: TK0_SM0201_690X390_MC; CHIPS_PART_NAME: CAP_2; CDS_PART_NAME: CAP_2_0201-J68586-001,X5R,2.2UF,10V,10%,TK0,GENERIC; CDS_LOCATION: C10977
C10978 = CAP_2: CDS_PHYS_PART_NAME: CAP_2_0201-J68586-001,X5R,2.2UF,10V,10%,TK0,GENERIC; CDS_LMAN_SYM_OUTLINE: -50,50,50,-50; FP_TECH: TK0; IP: GENERIC; ROOM: NONE; OriginalSymbolOrigin: (-50,25); XY: (-1400,625); VER: 1; ROT: 0; PHYS_PAGE: 244; LOCATION: C10978; DRAWING: @RVP1_ADL_SB_ADP_S_DDR5_SODIMM_2DPC_LIB.H55_DG2_2DPC(SCH_1):PAGE415; CDS_LIB: discrete_2; VARIANT: ?; PCB Footprint: TK0_SM0201_690X390_MC; CHIPS_PART_NAME: CAP_2; CDS_PART_NAME: CAP_2_0201-J68586-001,X5R,2.2UF,10V,10%,TK0,GENERIC; CDS_LOCATION: C10978
C10979 = CAP_2: CDS_PHYS_PART_NAME: CAP_2_0201-J68586-001,X5R,2.2UF,10V,10%,TK0,GENERIC; CDS_LMAN_SYM_OUTLINE: -50,50,50,-50; FP_TECH: TK0; IP: GENERIC; ROOM: NONE; OriginalSymbolOrigin: (-50,25); XY: (-950,625); VER: 1; ROT: 0; PHYS_PAGE: 244; LOCATION: C10979; DRAWING: @RVP1_ADL_SB_ADP_S_DDR5_SODIMM_2DPC_LIB.H55_DG2_2DPC(SCH_1):PAGE415; CDS_LIB: discrete_2; VARIANT: ?; PCB Footprint: TK0_SM0201_690X390_MC; CHIPS_PART_NAME: CAP_2; CDS_PART_NAME: CAP_2_0201-J68586-001,X5R,2.2UF,10V,10%,TK0,GENERIC; CDS_LOCATION: C10979
C10980 = CAP_2: CDS_PHYS_PART_NAME: CAP_2_0201-J68586-001,X5R,2.2UF,10V,10%,TK0,GENERIC; CDS_LMAN_SYM_OUTLINE: -50,50,50,-50; FP_TECH: TK0; IP: GENERIC; ROOM: NONE; OriginalSymbolOrigin: (-50,25); XY: (-500,625); VER: 1; ROT: 0; PHYS_PAGE: 244; LOCATION: C10980; DRAWING: @RVP1_ADL_SB_ADP_S_DDR5_SODIMM_2DPC_LIB.H55_DG2_2DPC(SCH_1):PAGE415; CDS_LIB: discrete_2; VARIANT: ?; PCB Footprint: TK0_SM0201_690X390_MC; CHIPS_PART_NAME: CAP_2; CDS_PART_NAME: CAP_2_0201-J68586-001,X5R,2.2UF,10V,10%,TK0,GENERIC; CDS_LOCATION: C10980
C10981 = CAP_2: CDS_PHYS_PART_NAME: CAP_2_0201-J68586-001,X5R,2.2UF,10V,10%,TK0,GENERIC; CDS_LMAN_SYM_OUTLINE: -50,50,50,-50; FP_TECH: TK0; IP: GENERIC; ROOM: NONE; OriginalSymbolOrigin: (-50,25); XY: (-50,625); VER: 1; ROT: 0; PHYS_PAGE: 244; LOCATION: C10981; DRAWING: @RVP1_ADL_SB_ADP_S_DDR5_SODIMM_2DPC_LIB.H55_DG2_2DPC(SCH_1):PAGE415; CDS_LIB: discrete_2; VARIANT: ?; PCB Footprint: TK0_SM0201_690X390_MC; CHIPS_PART_NAME: CAP_2; CDS_PART_NAME: CAP_2_0201-J68586-001,X5R,2.2UF,10V,10%,TK0,GENERIC; CDS_LOCATION: C10981
C10982 = CAP_2: CDS_PHYS_PART_NAME: CAP_2_0201-J68586-001,X5R,2.2UF,10V,10%,TK0,GENERIC; CDS_LMAN_SYM_OUTLINE: -50,50,50,-50; FP_TECH: TK0; IP: GENERIC; ROOM: NONE; OriginalSymbolOrigin: (-50,25); XY: (400,625); VER: 1; ROT: 0; PHYS_PAGE: 244; LOCATION: C10982; DRAWING: @RVP1_ADL_SB_ADP_S_DDR5_SODIMM_2DPC_LIB.H55_DG2_2DPC(SCH_1):PAGE415; CDS_LIB: discrete_2; VARIANT: ?; PCB Footprint: TK0_SM0201_690X390_MC; CHIPS_PART_NAME: CAP_2; CDS_PART_NAME: CAP_2_0201-J68586-001,X5R,2.2UF,10V,10%,TK0,GENERIC; CDS_LOCATION: C10982
C10983 = CAP_2: CDS_PHYS_PART_NAME: CAP_2_0201-J68586-001,X5R,2.2UF,10V,10%,TK0,GENERIC; CDS_LMAN_SYM_OUTLINE: -50,50,50,-50; FP_TECH: TK0; IP: GENERIC; ROOM: NONE; OriginalSymbolOrigin: (-50,25); XY: (850,625); VER: 1; ROT: 0; PHYS_PAGE: 244; LOCATION: C10983; DRAWING: @RVP1_ADL_SB_ADP_S_DDR5_SODIMM_2DPC_LIB.H55_DG2_2DPC(SCH_1):PAGE415; CDS_LIB: discrete_2; VARIANT: ?; PCB Footprint: TK0_SM0201_690X390_MC; CHIPS_PART_NAME: CAP_2; CDS_PART_NAME: CAP_2_0201-J68586-001,X5R,2.2UF,10V,10%,TK0,GENERIC; CDS_LOCATION: C10983
C10984 = CAP_2: CDS_PHYS_PART_NAME: CAP_2_0201-J68586-001,X5R,2.2UF,10V,10%,TK0,GENERIC; CDS_LMAN_SYM_OUTLINE: -50,50,50,-50; FP_TECH: TK0; IP: GENERIC; ROOM: NONE; OriginalSymbolOrigin: (-50,25); XY: (1300,625); VER: 1; ROT: 0; PHYS_PAGE: 244; LOCATION: C10984; DRAWING: @RVP1_ADL_SB_ADP_S_DDR5_SODIMM_2DPC_LIB.H55_DG2_2DPC(SCH_1):PAGE415; CDS_LIB: discrete_2; VARIANT: ?; PCB Footprint: TK0_SM0201_690X390_MC; CHIPS_PART_NAME: CAP_2; CDS_PART_NAME: CAP_2_0201-J68586-001,X5R,2.2UF,10V,10%,TK0,GENERIC; CDS_LOCATION: C10984
C10985 = CAP_2: CDS_PHYS_PART_NAME: CAP_2_0201-J68586-001,X5R,2.2UF,10V,10%,TK0,GENERIC; CDS_LMAN_SYM_OUTLINE: -50,50,50,-50; FP_TECH: TK0; IP: GENERIC; ROOM: NONE; OriginalSymbolOrigin: (-50,25); XY: (1750,625); VER: 1; ROT: 0; PHYS_PAGE: 244; LOCATION: C10985; DRAWING: @RVP1_ADL_SB_ADP_S_DDR5_SODIMM_2DPC_LIB.H55_DG2_2DPC(SCH_1):PAGE415; CDS_LIB: discrete_2; VARIANT: ?; PCB Footprint: TK0_SM0201_690X390_MC; CHIPS_PART_NAME: CAP_2; CDS_PART_NAME: CAP_2_0201-J68586-001,X5R,2.2UF,10V,10%,TK0,GENERIC; CDS_LOCATION: C10985
C10986 = CAP_2: CDS_PHYS_PART_NAME: CAP_2_0201-J68586-001,X5R,2.2UF,10V,10%,TK0,GENERIC; CDS_LMAN_SYM_OUTLINE: -50,50,50,-50; FP_TECH: TK0; IP: GENERIC; ROOM: NONE; OriginalSymbolOrigin: (-50,25); XY: (2225,625); VER: 1; ROT: 0; PHYS_PAGE: 244; LOCATION: C10986; DRAWING: @RVP1_ADL_SB_ADP_S_DDR5_SODIMM_2DPC_LIB.H55_DG2_2DPC(SCH_1):PAGE415; CDS_LIB: discrete_2; VARIANT: ?; PCB Footprint: TK0_SM0201_690X390_MC; CHIPS_PART_NAME: CAP_2; CDS_PART_NAME: CAP_2_0201-J68586-001,X5R,2.2UF,10V,10%,TK0,GENERIC; CDS_LOCATION: C10986
C10987 = CAP_2: CDS_PHYS_PART_NAME: CAP_2_0201-J68586-001,X5R,2.2UF,10V,10%,TK0,GENERIC; CDS_LMAN_SYM_OUTLINE: -50,50,50,-50; FP_TECH: TK0; IP: GENERIC; ROOM: NONE; OriginalSymbolOrigin: (-50,25); XY: (2675,625); VER: 1; ROT: 0; PHYS_PAGE: 244; LOCATION: C10987; DRAWING: @RVP1_ADL_SB_ADP_S_DDR5_SODIMM_2DPC_LIB.H55_DG2_2DPC(SCH_1):PAGE415; CDS_LIB: discrete_2; VARIANT: ?; PCB Footprint: TK0_SM0201_690X390_MC; CHIPS_PART_NAME: CAP_2; CDS_PART_NAME: CAP_2_0201-J68586-001,X5R,2.2UF,10V,10%,TK0,GENERIC; CDS_LOCATION: C10987
C10988 = CAP_2: CDS_PHYS_PART_NAME: CAP_2_0201-J68586-001,X5R,2.2UF,10V,10%,TK0,GENERIC; CDS_LMAN_SYM_OUTLINE: -50,50,50,-50; FP_TECH: TK0; IP: GENERIC; ROOM: NONE; OriginalSymbolOrigin: (-50,25); XY: (3125,625); VER: 1; ROT: 0; PHYS_PAGE: 244; LOCATION: C10988; DRAWING: @RVP1_ADL_SB_ADP_S_DDR5_SODIMM_2DPC_LIB.H55_DG2_2DPC(SCH_1):PAGE415; CDS_LIB: discrete_2; VARIANT: ?; PCB Footprint: TK0_SM0201_690X390_MC; CHIPS_PART_NAME: CAP_2; CDS_PART_NAME: CAP_2_0201-J68586-001,X5R,2.2UF,10V,10%,TK0,GENERIC; CDS_LOCATION: C10988
C10989 = CAP_2: CDS_PHYS_PART_NAME: CAP_2_0201-J68586-001,X5R,2.2UF,10V,10%,TK0,GENERIC; CDS_LMAN_SYM_OUTLINE: -50,50,50,-50; FP_TECH: TK0; IP: GENERIC; ROOM: NONE; OriginalSymbolOrigin: (-50,25); XY: (3575,625); VER: 1; ROT: 0; PHYS_PAGE: 244; LOCATION: C10989; DRAWING: @RVP1_ADL_SB_ADP_S_DDR5_SODIMM_2DPC_LIB.H55_DG2_2DPC(SCH_1):PAGE415; CDS_LIB: discrete_2; VARIANT: ?; PCB Footprint: TK0_SM0201_690X390_MC; CHIPS_PART_NAME: CAP_2; CDS_PART_NAME: CAP_2_0201-J68586-001,X5R,2.2UF,10V,10%,TK0,GENERIC; CDS_LOCATION: C10989
C10990 = CAP_2: CDS_PHYS_PART_NAME: CAP_2_0201-J68586-001,X5R,2.2UF,10V,10%,TK0,GENERIC; CDS_LMAN_SYM_OUTLINE: -50,50,50,-50; FP_TECH: TK0; IP: GENERIC; ROOM: NONE; OriginalSymbolOrigin: (-50,25); XY: (4025,625); VER: 1; ROT: 0; PHYS_PAGE: 244; LOCATION: C10990; DRAWING: @RVP1_ADL_SB_ADP_S_DDR5_SODIMM_2DPC_LIB.H55_DG2_2DPC(SCH_1):PAGE415; CDS_LIB: discrete_2; VARIANT: ?; PCB Footprint: TK0_SM0201_690X390_MC; CHIPS_PART_NAME: CAP_2; CDS_PART_NAME: CAP_2_0201-J68586-001,X5R,2.2UF,10V,10%,TK0,GENERIC; CDS_LOCATION: C10990
C10991 = CAP_2: CDS_PHYS_PART_NAME: CAP_2_0201-J68586-001,X5R,2.2UF,10V,10%,TK0,GENERIC; CDS_LMAN_SYM_OUTLINE: -50,50,50,-50; FP_TECH: TK0; IP: GENERIC; ROOM: NONE; OriginalSymbolOrigin: (-50,25); XY: (4475,625); VER: 1; ROT: 0; PHYS_PAGE: 244; LOCATION: C10991; DRAWING: @RVP1_ADL_SB_ADP_S_DDR5_SODIMM_2DPC_LIB.H55_DG2_2DPC(SCH_1):PAGE415; CDS_LIB: discrete_2; VARIANT: ?; PCB Footprint: TK0_SM0201_690X390_MC; CHIPS_PART_NAME: CAP_2; CDS_PART_NAME: CAP_2_0201-J68586-001,X5R,2.2UF,10V,10%,TK0,GENERIC; CDS_LOCATION: C10991